# Altium schematic sheet [04] - COMMUNICATION.SchDoc
size A3; DocumentNumber: 4; SheetNumber: 4; SheetTotal: 10
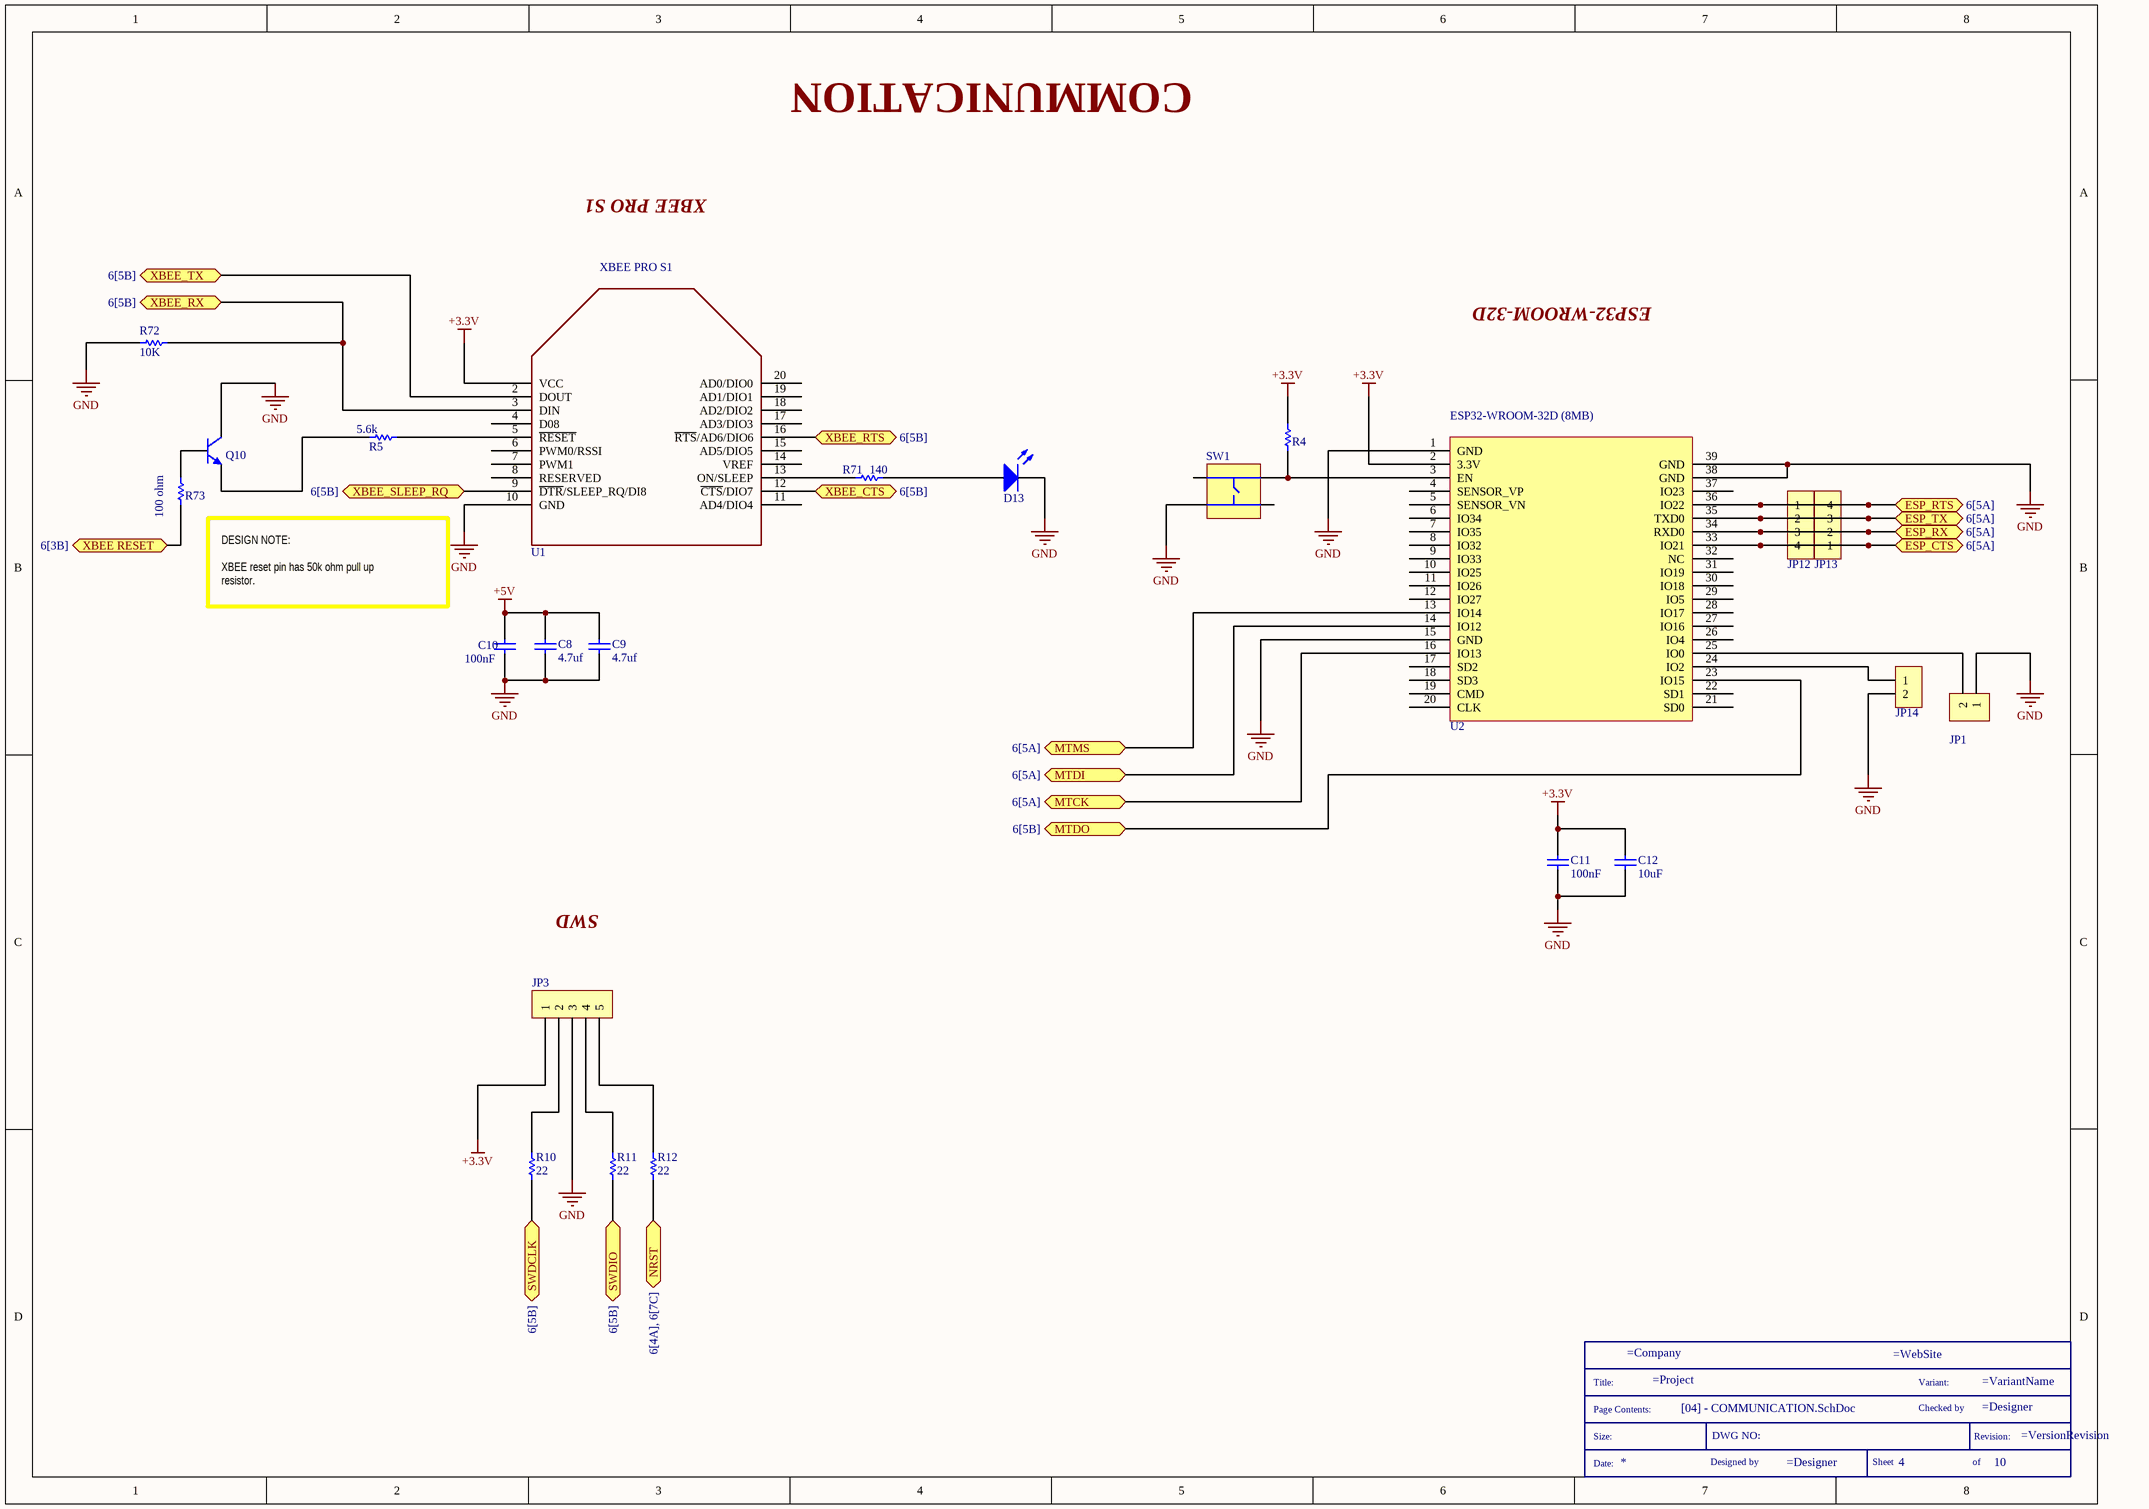
[diagram p0: [04] - COMMUNICATION.SchDoc]

## Parts
*  SCH_TITLE  (value not drawn)  (graphical)
C8  4.7uf  [CAP_CER_0603]
C9  4.7uf  [CAP_CER_0603]
C10  100nF  [CAP_CER_0603]
C11  100nF  [CAP_CER_0603]
C12  10uF  [CAP_CER_0805]
D13  Blue Led  [RES_0603]  (value not drawn)
JP1  HDR 1X2 2.54MM  [HDR_FEMALE_1X2_2.54MM]  (value not drawn)
JP3  HDR FEMALE 1X5 2.54MM  [HDR_FEMALE_1X5_2.54MM]  (value not drawn)
JP12  HDR FEMALE 1X4 2.54MM  [HDR_FEMALE_1X4_2.54MM]  (value not drawn)
JP13  HDR FEMALE 1X4 2.54MM  [HDR_FEMALE_1X4_2.54MM]  (value not drawn)
JP14  HDR 1X2 2.54MM  [HDR_FEMALE_1X2_2.54MM]  (value not drawn)
Q10  NPN 0.6A  [SOT-23 (TO-236)]  (value not drawn)
R4  1K 1/8W  [RES_0805]  (value not drawn)
R5  5.6k  [RES_0805]
R10  22  [RES_0805]
R11  22  [RES_0805]
R12  22  [RES_0805]
R71  140  [RES_0805]
R72  10K  [RES_0805]
R73  100 ohm  [RES_0805]
SW1  PTS 647 SK38 SMTR2 LFS  [4.5x4.5 Tactile switch]  (value not drawn)
U1  XBEE PRO S1  [XBEE PRO S1]
U2  ESP32-WROOM-32D (8MB)  [ESP32-WROOM-32D]

## Ports
ESP_CTS (see 6[5A]), ESP_RTS (see 6[5A]), ESP_RX (see 6[5A]), ESP_TX (see 6[5A]), MTCK (see 6[5A]), MTDI (see 6[5A]), MTDO (see 6[5B]), MTMS (see 6[5A]), NRST (see 6[4A], 6[7C]), SWDCLK (see 6[5B]), SWDIO (see 6[5B]), XBEE RESET (see 6[3B]), XBEE_CTS (see 6[5B]), XBEE_RTS (see 6[5B]), XBEE_RX (see 6[5B]), XBEE_SLEEP_RQ (see 6[5B]), XBEE_TX (see 6[5B])

## Nets
+3.3V: C11.2 C12.2 JP3.1 R4.2 U1.1(VCC) U2.2(3.3V)
+5V: C8.2 C9.2 C10.2
GND: C8.1 C9.1 C10.1 C11.1 C12.1 D13.2(K) JP1.1 JP3.3 JP14.2 Q10.1(C) R72.1 SW1.3 U1.10(GND) U2.1(GND) U2.15(GND) U2.38(GND) U2.39(GND)
ESP_CTS: JP12.4 JP13.1 U2.33(IO21) ; port ESP_CTS
ESP_RTS: JP12.1 JP13.4 U2.36(IO22) ; port ESP_RTS
ESP_RX: JP12.3 JP13.2 U2.34(RXD0) ; port ESP_RX
ESP_TX: JP12.2 JP13.3 U2.35(TXD0) ; port ESP_TX
MTCK: U2.16(IO13) ; port MTCK
MTDI: U2.14(IO12) ; port MTDI
MTDO: U2.23(IO15) ; port MTDO
MTMS: U2.13(IO14) ; port MTMS
NRST: R12.1 ; port NRST
SWDCLK: R10.1 ; port SWDCLK
SWDIO: R11.1 ; port SWDIO
XBEE RESET: R73.1 ; port XBEE RESET
XBEE_CTS: U1.12(~{CTS}/DIO7) ; port XBEE_CTS
XBEE_RTS: U1.16(~{RTS}/AD6/DIO6) ; port XBEE_RTS
XBEE_RX: R72.2 U1.3(DIN) ; port XBEE_RX
XBEE_SLEEP_RQ: U1.9(~{DTR}/SLEEP_RQ/DI8) ; port XBEE_SLEEP_RQ
XBEE_TX: U1.2(DOUT) ; port XBEE_TX
NetD13_1: D13.1(A) R71.2
NetJP1_2: JP1.2 U2.25(IO0)
NetJP3_2: JP3.2 R10.2
NetJP3_4: JP3.4 R11.2
NetJP3_5: JP3.5 R12.2
NetJP14_1: JP14.1 U2.24(IO2)
NetQ10_2: Q10.2(B) R73.2
NetQ10_3: Q10.3(E) R5.2
NetR4_1: R4.1 SW1.2 U2.3(EN)
NetR5_1: R5.1 U1.5(~{RESET})
NetR71_1: R71.1 U1.13(ON/SLEEP)

Not connected (* = marked no-connect by the designer): SW1 1 4; U1 4(D08) 6(PWM0/RSSI) 7(PWM1) 8(RESERVED) 11(AD4/DIO4) 14(VREF) 15(AD5/DIO5) 17(AD3/DIO3) 18(AD2/DIO2) 19(AD1/DIO1) 20(AD0/DIO0); U2 4(SENSOR_VP) 5(SENSOR_VN) 6(IO34) 7(IO35) 8(IO32) 9(IO33) 10(IO25) 11(IO26) 12(IO27) 17(SD2) 18(SD3) 19(CMD) 20(CLK) 21(SD0) 22(SD1) 26(IO4) 27(IO16) 28(IO17) 29(IO5) 30(IO18) 31(IO19) 32(NC) 37(IO23)

## Notes on the sheet
- COMMUNICATION
- XBEE PRO S1
- ESP32-WROOM-32D
- DESIGN NOTE:
  XBEE reset pin has 50k ohm pull up resistor.
- SWD
- (in symbol SCH_TITLE) Title:; Variant:; Page Contents:; Checked by; Size:; DWG NO:; Revision:; Date:; Designed by; Sheet; of

## Library data of the parts
* = SCH_TITLE: Schematic information
C8 C9 = CGA3E2C0G1H4R7C080AA: CAP CER 4.7PF 50V C0G 0603; Manufacturer 1: TDK Corporation; Category: Ceramic Capacitors; Manufacturer Part Number 1: CGA3E2C0G1H4R7C080AA; Case/Package: 0603 (1608 Metric); Quantity: 1; Supplier 1: Digikey; Supplier Part Number 1: 445-5621-1-ND; Supplier Stock 1: 68332; Supplier Unit Price 1: 0.19; Supplier Currency 1: $
C10 C11 = GMK107BJ104KAHT: CAP CER 100nf 35V X5R 0603; Manufacturer 1: Taiyo Yuden; Category: Ceramic Capacitors; Manufacturer Part Number 1: GMK107BJ104KAHT; Case/Package: 0603 (1608 Metric); Quantity: 1; Supplier 1: Digikey; Supplier Part Number 1: 587-3357-1-ND; Supplier Order Qty 1: 1; Supplier Stock 1: 97932; Supplier Unit Price 1: 0,14; Supplier Currency 1: $
C12 = CGA4J1X5R1C106M125AC: CAP CER 10UF 16V; Manufacturer 1: TDK Corporation; Category: Ceramic Capacitors; Manufacturer Part Number 1: CGA4J1X5R1C106M125AC; Case/Package: 0805 (2012 Metric); Quantity: 1; Supplier 1: Digikey; Supplier Part Number 1: 445-12654-1-ND; Supplier Order Qty 1: 1; Supplier Stock 1: 39905; Supplier Unit Price 1: 0,5; Supplier Currency 1: $
D13 = EAST16084BA8: LED BLUE CLEAR 2SMD; Manufacturer 1: Everlight Electronics Co Ltd; Category: LED Indication - Discrete; Manufacturer Part Number 1: EAST16084BA8; Case/Package: 0603 (1608 Metric); Quantity: 1; Supplier 1: Digikey; Supplier Part Number 1: 1080-1562-1-ND; Supplier Stock 1: 11914; Supplier Unit Price 1: 0.30; Supplier Currency 1: $
JP1 JP14 = PPTC021LFBN-RC: HDR FEMALE 1X2 2.54MM; Manufacturer 1: Sullins Connector Solutions; Category: Rectangular Connectors - Headers, Receptacles, Female Sockets; Manufacturer Part Number 1: PPTC021LFBN-RC; Case/Package: 2POS_2.54mmPitch; Quantity: 1; Supplier 1: Digikey; Supplier Part Number 1: S7000-ND; Supplier Order Qty 1: 1; Supplier Stock 1: 46723; Supplier Unit Price 1: 0,32; Supplier Currency 1: $
JP3 = PPTC051LFBN-RC: Manufacturer 1: Sullins Connector Solutions; Category: Rectangular Connectors - Headers, Receptacles, Female Sockets; Manufacturer Part Number 1: PPTC051LFBN-RC; Case/Package: 5Pos_2.5mm_Pitch; Quantity: 1; Supplier 1: Digikey; Supplier Part Number 1: S6103-ND; Supplier Order Qty 1: 1; Supplier Stock 1: 28189; Supplier Unit Price  1: 0,47; Supplier Currency 1: $
JP12 JP13 = PPTC041LFBN-RC: Manufacturer 1: Sullins Connector Solutions; Category: Rectangular Connectors - Headers, Receptacles, Female Sockets; Case/Package: 4POS_2.54mmPitch; Manufacturer Part Number 1: PPTC041LFBN-RC; Quantity: 1; Supplier 1: Digikey; Supplier Part Number 1: S7002-ND; Supplier Order Qty 1: 1; Supplier Stock 1: 30769; Supplier Unit Price 1: 0,45; Supplier Currency 1: $
Q10 = MMBT2222A-7-F: TRANS NPN 40V 0.6A SMD SOT23-3; Manufacturer 1: Diodes Incorporated; Category: Transistors - Bipolar (BJT) - Single; Manufacturer Part Number 1: MMBT2222A-7-F; Case/Package: SOT-23-3; Quantity: 1; Supplier 1: Digikey; Supplier Part Number 1: MMBT2222A-FDICT-ND; Supplier Order Qty 1: 1; Supplier Stock 1: 1957039; Supplier Unit Price 1: 0,14; Supplier Currency 1: $
R4 = ERJ-6ENF1001V: RES SMD 1K OHM; Manufacturer 1: Panasonic Electronic Components; Category: Chip Resistor - Surface Mount; Manufacturer Part Number 1: ERJ-6ENF1001V; Case/Package: 0805 (2012 Metric); Quantity: 1; Supplier 1: Digikey; Supplier Part Number 1: P1.00KCCT-ND; Supplier Order Qty 1: 1; Supplier Stock 1: 1361018; Supplier Unit Price 1: 0,1; Supplier Currency 1: $
R5 = ERJ-6ENF5601V: RES SMD 5.6K OHM 1% 1/8W 0805; Manufacturer 1: Panasonic Electronic Components; Category: Chip Resistor - Surface Mount; Manufacturer Part Number 1: ERJ-6ENF5601V; Case/Package: 0805 (2012 Metric); Quantity: 1; Supplier 1: Digikey; Supplier Part Number 1: P5.60KCCT-ND; Supplier Order Qty 1: 1; Supplier Stock 1: 71341; Supplier Unit Price 1: 0,1; Supplier Currency 1: $
R10-R12 = ERJ-6GEYJ220V: RES SMD 22 OHM 5% 1/8W 0805; Manufacturer 1: Panasonic Electronic Components; Category: Chip Resistor - Surface Mount; Manufacturer Part Number 1: ERJ-6GEYJ220V; Case/Package: 0805; Quantity: 1; Supplier 1: Digikey; Supplier Part Number 1: P22ACT-ND; Supplier Stock 1: 247578; Supplier Unit Price 1: 0.1; Supplier Currency 1: $
R71 = ERJ-6ENF1400V: RES SMD 140 OHM 1% 1/8W 0805; Manufacturer 1: Panasonic Electronic Components; Category: Chip Resistor - Surface Mount; Manufacturer Part Number 1: ERJ-6ENF1400V; Case/Package: 0805 (2012 Metric); Quantity: 1; Supplier 1: Digikey; Supplier Part Number 1: P140CCT-ND; Supplier Order Qty 1: 1; Supplier Stock 1: 76818; Supplier Unit Price 1: 0,1; Supplier Currency 1: $
R72 = ERJ-6ENF1002V: RES SMD 10K OHM 1% 1/8W 0805; Manufacturer 1: Panasonic Electronic Components; Category: Chip Resistor - Surface Mount; Manufacturer Part Number 1: ERJ-6ENF1002V; Case/Package: 0805 (2012 Metric); Quantity: 1; Supplier 1: Digikey; Supplier Part Number 1: P10.0KCCT-ND; Supplier Order Qty 1: 1; Supplier Stock 1: 2515107; Supplier Unit Price 1: 0,1; Supplier Currency 1: $
R73 = ERJ-6ENF1000V: RES SMD 100 OHM; Manufacturer 1: Panasonic Electronic Components; Category: Chip Resistor - Surface Mount; Manufacturer Part Number 1: ERJ-6ENF1000V; Case/Package: 0805 (2012 Metric); Quantity: 1; Supplier 1: Digikey; Supplier Part Number 1: P100CCT-ND; Supplier Order Qty 1: 1; Supplier Stock 1: 728141; Supplier Unit Price 1: 0,1; Supplier Currency 1: $
SW1 = PTS 647 SK38 SMTR2 LFS: SWITCH TACTILE 4.5 X 4.5; Manufacturer 1: C&K; Category: Tactile Switches; Manufacturer Part Number 1: PTS 647 SK38 SMTR2 LFS; Case/Package: 4.50mm x 4.50mm; Quantity: 1; Supplier 1: Digikey; Supplier Part Number 1: PTS647SK38SMTR2LFSCT-ND; Supplier Stock 1: 73195; Supplier Unit Price 1: 0.14; Supplier Currency 1: $
U1 = XBP24-DKSJ: XBEE PRO SERIES1; Manufacturer 1: Digi International; Category: RF Evaluation and Development Kits, Boards; Manufacturer Part Number 1: XBP24-DKSJ; Case/Package: THT; Quantity: 1; Supplier 1: Digikey; Supplier Part Number 1: 602-1590-ND; Supplier Stock 1: 0; Supplier Unit Price 1: -; Supplier Currency 1: $
U2 = ESP32-WROOM-32D (8MB): ESP32 WIFI MODULE 64MBITS SPI FLASH; Manufacturer 1: Espressif Systems; Category: RF Transceiver Modules; Manufacturer Part Number 1: ESP32-WROOM-32D (8MB); Case/Package: SMD; Quantity: 1; Supplier 1: Digikey; Supplier Part Number 1: 1904-1024-1-ND; Supplier Stock 1: 1298; Supplier Unit Price 1: 4.2; Supplier Currency 1: $